# Altium schematic sheet Source_Trans.SchDoc
size A4; DocumentNumber: 1; SheetNumber: 1; SheetTotal: 1
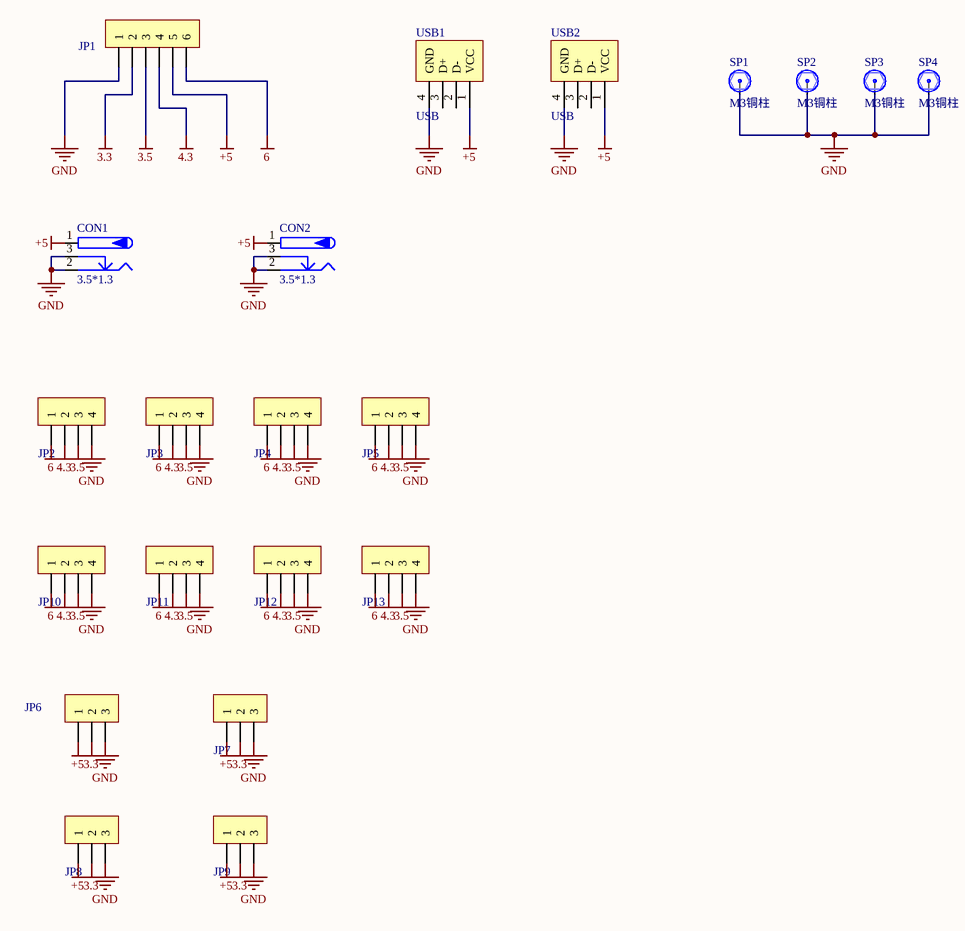
[diagram p0: Source_Trans.SchDoc]

## Parts
CON1  3.5*1.3  [DC-005]
CON2  3.5*1.3  [DC-005]
JP1  HDR-1X6  [XH2.54-WS-6P]  (value not drawn)
JP2  HDR-1X4  [XH2.54-LI-4P]  (value not drawn)
JP3  HDR-1X4  [XH2.54-LI-4P]  (value not drawn)
JP4  HDR-1X4  [XH2.54-LI-4P]  (value not drawn)
JP5  HDR-1X4  [XH2.54-LI-4P]  (value not drawn)
JP6  HDR-1X3  [XH2.54-LI-3P]  (value not drawn)
JP7  HDR-1X3  [XH2.54-LI-3P]  (value not drawn)
JP8  HDR-1X3  [XH2.54-LI-3P]  (value not drawn)
JP9  HDR-1X3  [XH2.54-LI-3P]  (value not drawn)
JP10  HDR-1X4  [XH2.54-LI-4P]  (value not drawn)
JP11  HDR-1X4  [XH2.54-LI-4P]  (value not drawn)
JP12  HDR-1X4  [XH2.54-LI-4P]  (value not drawn)
JP13  HDR-1X4  [XH2.54-LI-4P]  (value not drawn)
SP1  M3铜柱  [M3x4_L]
SP2  M3铜柱  [M3x4_L]
SP3  M3铜柱  [M3x4_L]
SP4  M3铜柱  [M3x4_L]
USB1  USB  [USB-A/S_A]
USB2  USB  [USB-A/S_A]

## Nets
3.3: JP1.2 JP6.2 JP7.2 JP8.2 JP9.2
3.5: JP1.3 JP2.3 JP3.3 JP4.3 JP5.3 JP10.3 JP11.3 JP12.3 JP13.3
4.3: JP1.4 JP2.2 JP3.2 JP4.2 JP5.2 JP10.2 JP11.2 JP12.2 JP13.2
6: JP1.6 JP2.1 JP3.1 JP4.1 JP5.1 JP10.1 JP11.1 JP12.1 JP13.1
+5: CON1.1 CON2.1 JP1.5 JP6.1 JP7.1 JP8.1 JP9.1 USB1.1(VCC) USB2.1(VCC)
GND: CON1.2 CON1.3 CON2.2 CON2.3 JP1.1 JP2.4 JP3.4 JP4.4 JP5.4 JP6.3 JP7.3 JP8.3 JP9.3 JP10.4 JP11.4 JP12.4 JP13.4 SP1.1 SP2.1 SP3.1 SP4.1 USB1.4(GND) USB2.4(GND)

Not connected (* = marked no-connect by the designer): USB1 2(D-) 3(D+); USB2 2(D-) 3(D+)

## Library data of the parts
CON1 CON2 = P-DC: 低压电源接口; BOM名称: DC电源接口
JP1 = Header 6: 6P接插件; BOM名称: 6P接插件
JP2-JP5 JP10-JP13 = Header 4: 4P接插件; BOM名称: 4P接插件
JP6-JP9 = Header 3: 3P接插件; BOM名称: 3P接插件
SP1-SP4 = 铜柱小焊盘: 铜柱; BOM名称: 铜柱
USB1 USB2 = USB-A/S: USB-A型母接口; BOM名称: USB-A型母接口